# Altium schematic sheet CAN_Optical.SchDoc
size C
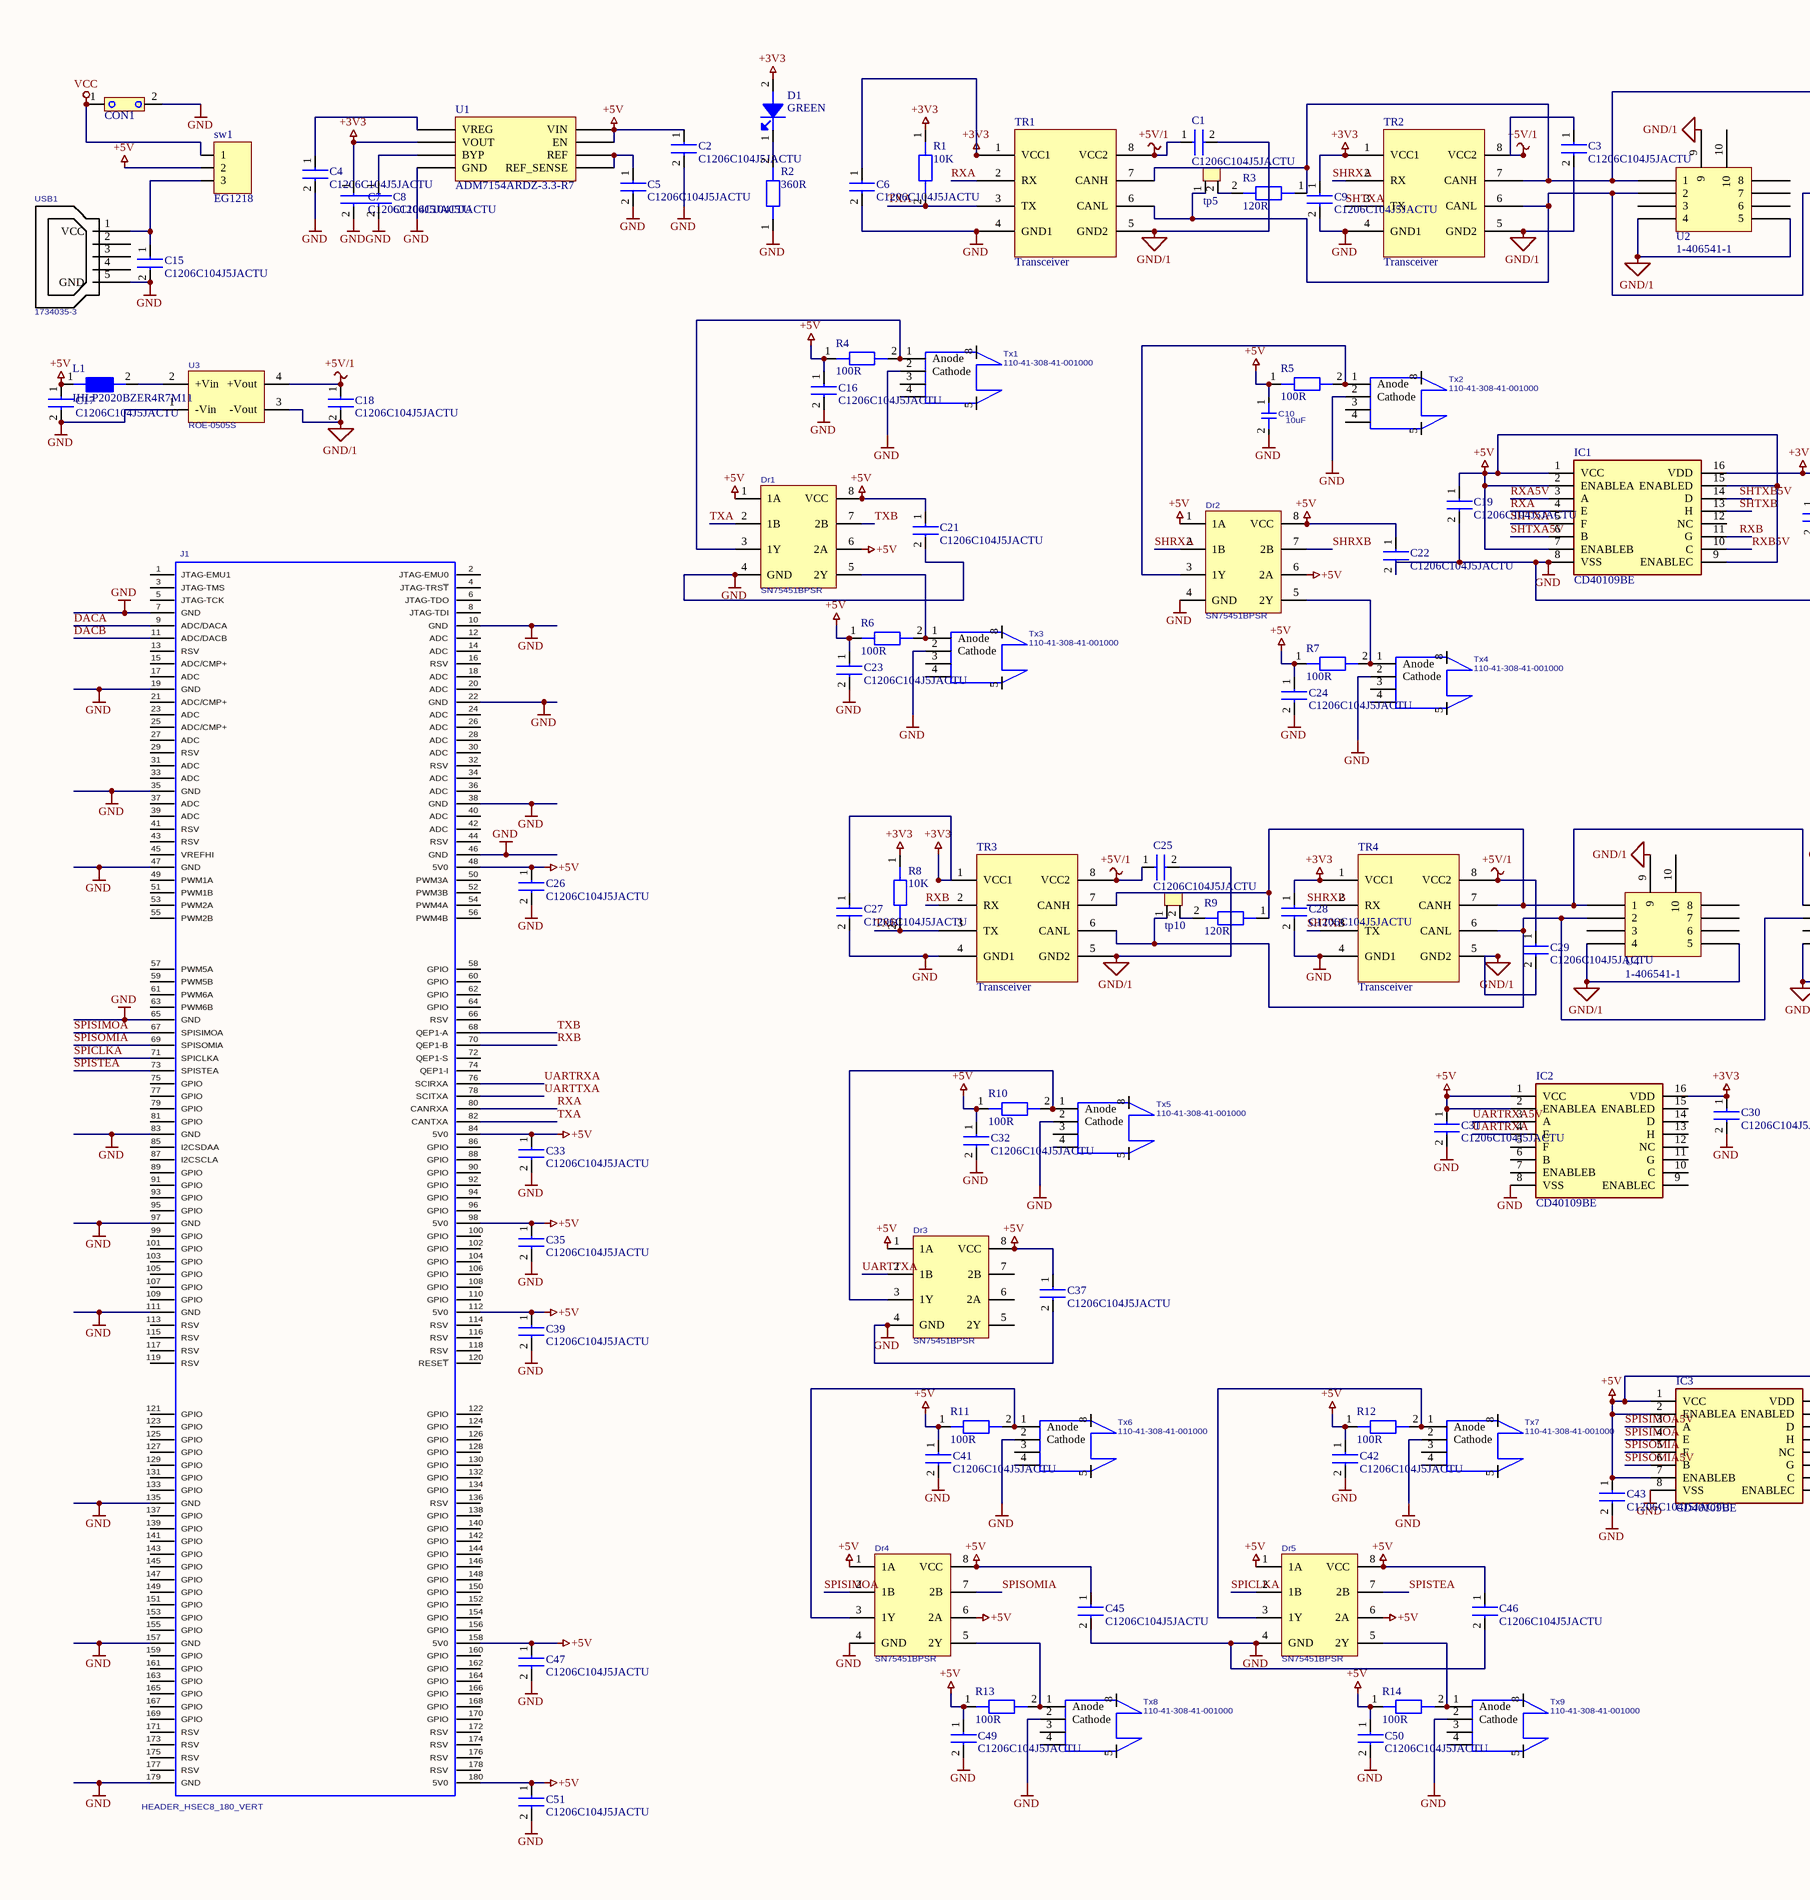
[diagram p0: CAN_Optical.SchDoc, left]
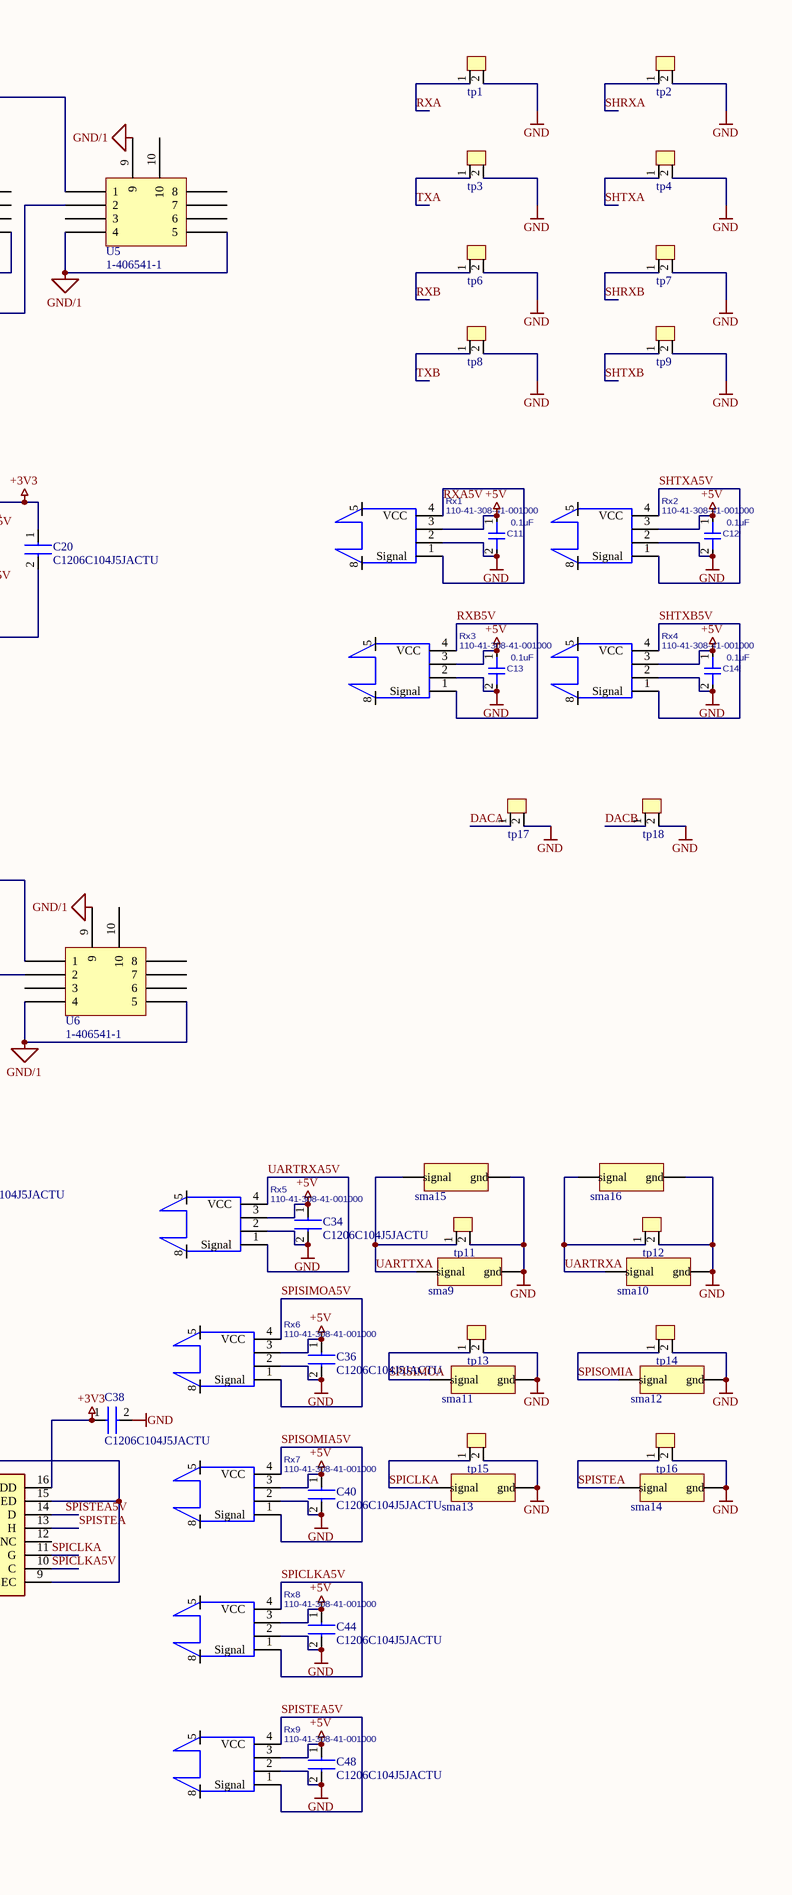
[diagram p1: CAN_Optical.SchDoc, right]

## Parts
C1  C1206C104J5JACTU  [CAPC3216X135N]
C2  C1206C104J5JACTU  [CAPC3216X135N]
C3  C1206C104J5JACTU  [CAPC3216X135N]
C4  C1206C104J5JACTU  [CAPC3216X135N]
C5  C1206C104J5JACTU  [CAPC3216X135N]
C6  C1206C104J5JACTU  [CAPC3216X135N]
C7  C1206C104J5JACTU  [CAPC3216X135N]
C8  C1206C104J5JACTU  [CAPC3216X135N]
C9  C1206C104J5JACTU  [CAPC3216X135N]
C10  10uF  [CAPC3216X135N]
C11  0.1uF  [CAPC3216X135N]
C12  0.1uF  [CAPC3216X135N]
C13  0.1uF  [CAPC3216X135N]
C14  0.1uF  [CAPC3216X135N]
C15  C1206C104J5JACTU  [CAPC3216X135N]
C16  C1206C104J5JACTU  [CAPC3216X135N]
C17  C1206C104J5JACTU  [CAPC3216X135N]
C18  C1206C104J5JACTU  [CAPC3216X135N]
C19  C1206C104J5JACTU  [CAPC3216X135N]
C20  C1206C104J5JACTU  [CAPC3216X135N]
C21  C1206C104J5JACTU  [CAPC3216X135N]
C22  C1206C104J5JACTU  [CAPC3216X135N]
C23  C1206C104J5JACTU  [CAPC3216X135N]
C24  C1206C104J5JACTU  [CAPC3216X135N]
C25  C1206C104J5JACTU  [CAPC3216X135N]
C26  C1206C104J5JACTU  [CAPC3216X135N]
C27  C1206C104J5JACTU  [CAPC3216X135N]
C28  C1206C104J5JACTU  [CAPC3216X135N]
C29  C1206C104J5JACTU  [CAPC3216X135N]
C30  C1206C104J5JACTU  [CAPC3216X135N]
C31  C1206C104J5JACTU  [CAPC3216X135N]
C32  C1206C104J5JACTU  [CAPC3216X135N]
C33  C1206C104J5JACTU  [CAPC3216X135N]
C34  C1206C104J5JACTU  [CAPC3216X135N]
C35  C1206C104J5JACTU  [CAPC3216X135N]
C36  C1206C104J5JACTU  [CAPC3216X135N]
C37  C1206C104J5JACTU  [CAPC3216X135N]
C38  C1206C104J5JACTU  [CAPC3216X135N]
C39  C1206C104J5JACTU  [CAPC3216X135N]
C40  C1206C104J5JACTU  [CAPC3216X135N]
C41  C1206C104J5JACTU  [CAPC3216X135N]
C42  C1206C104J5JACTU  [CAPC3216X135N]
C43  C1206C104J5JACTU  [CAPC3216X135N]
C44  C1206C104J5JACTU  [CAPC3216X135N]
C45  C1206C104J5JACTU  [CAPC3216X135N]
C46  C1206C104J5JACTU  [CAPC3216X135N]
C47  C1206C104J5JACTU  [CAPC3216X135N]
C48  C1206C104J5JACTU  [CAPC3216X135N]
C49  C1206C104J5JACTU  [CAPC3216X135N]
C50  C1206C104J5JACTU  [CAPC3216X135N]
C51  C1206C104J5JACTU  [CAPC3216X135N]
CON1  ED700/2  [ED700/2]  (value not drawn)
D1  GREEN  [LED0603G]
Dr1  SN75451BPSR  [SN75451BPS]
Dr2  SN75451BPSR  [SN75451BPS]
Dr3  SN75451BPSR  [SN75451BPS]
Dr4  SN75451BPSR  [SN75451BPS]
Dr5  SN75451BPSR  [SN75451BPS]
IC1  CD40109BE  [DIP794W53P254L1930H508Q16N]
IC2  CD40109BE  [DIP794W53P254L1930H508Q16N]
IC3  CD40109BE  [DIP794W53P254L1930H508Q16N]
J1  HEADER_HSEC8_180_VERT  [HEADER_HSEC8_180_DV]
L1  IHLP2020BZER4R7M11  [L_IHLP2020BZER4R7M11]
R1  10K  [R0805 - duplicate - duplicate]
R2  360R  [R0805 - duplicate - duplicate]
R3  120R  [R0805 - duplicate - duplicate]
R4  100R  [R0805 - duplicate - duplicate]
R5  100R  [R0805 - duplicate - duplicate]
R6  100R  [R0805 - duplicate - duplicate]
R7  100R  [R0805 - duplicate - duplicate]
R8  10K  [R0805 - duplicate - duplicate]
R9  120R  [R0805 - duplicate - duplicate]
R10  100R  [R0805 - duplicate - duplicate]
R11  100R  [R0805 - duplicate - duplicate]
R12  100R  [R0805 - duplicate - duplicate]
R13  100R  [R0805 - duplicate - duplicate]
R14  100R  [R0805 - duplicate - duplicate]
Rx1  110-41-308-41-001000  [HFBRX5XXZ]
Rx2  110-41-308-41-001000  [HFBRX5XXZ]
Rx3  110-41-308-41-001000  [HFBRX5XXZ]
Rx4  110-41-308-41-001000  [HFBRX5XXZ]
Rx5  110-41-308-41-001000  [HFBRX5XXZ]
Rx6  110-41-308-41-001000  [HFBRX5XXZ]
Rx7  110-41-308-41-001000  [HFBRX5XXZ]
Rx8  110-41-308-41-001000  [HFBRX5XXZ]
Rx9  110-41-308-41-001000  [HFBRX5XXZ]
sma9  142-0701-201  [142-0701-201]  (value not drawn)
sma10  142-0701-201  [142-0701-201]  (value not drawn)
sma11  142-0701-201  [142-0701-201]  (value not drawn)
sma12  142-0701-201  [142-0701-201]  (value not drawn)
sma13  142-0701-201  [142-0701-201]  (value not drawn)
sma14  142-0701-201  [142-0701-201]  (value not drawn)
sma15  142-0701-201  [142-0701-201]  (value not drawn)
sma16  142-0701-201  [142-0701-201]  (value not drawn)
sw1  EG1218  [EG1218]
tp1  tp2  [tp2]  (value not drawn)
tp2  tp2  [tp2]  (value not drawn)
tp3  tp2  [tp2]  (value not drawn)
tp4  tp2  [tp2]  (value not drawn)
tp5  tp2  [tp2]  (value not drawn)
tp6  tp2  [tp2]  (value not drawn)
tp7  tp2  [tp2]  (value not drawn)
tp8  tp2  [tp2]  (value not drawn)
tp9  tp2  [tp2]  (value not drawn)
tp10  tp2  [tp2]  (value not drawn)
tp11  tp2  [tp2]  (value not drawn)
tp12  tp2  [tp2]  (value not drawn)
tp13  tp2  [tp2]  (value not drawn)
tp14  tp2  [tp2]  (value not drawn)
tp15  tp2  [tp2]  (value not drawn)
tp16  tp2  [tp2]  (value not drawn)
tp17  tp2  [tp2]  (value not drawn)
tp18  tp2  [tp2]  (value not drawn)
TR1  Transceiver  [RXTX_ISO1050]
TR2  Transceiver  [RXTX_ISO1050]
TR3  Transceiver  [RXTX_ISO1050]
TR4  Transceiver  [RXTX_ISO1050]
Tx1  110-41-308-41-001000  [HFBRX5XXZ]
Tx2  110-41-308-41-001000  [HFBRX5XXZ]
Tx3  110-41-308-41-001000  [HFBRX5XXZ]
Tx4  110-41-308-41-001000  [HFBRX5XXZ]
Tx5  110-41-308-41-001000  [HFBRX5XXZ]
Tx6  110-41-308-41-001000  [HFBRX5XXZ]
Tx7  110-41-308-41-001000  [HFBRX5XXZ]
Tx8  110-41-308-41-001000  [HFBRX5XXZ]
Tx9  110-41-308-41-001000  [HFBRX5XXZ]
U1  ADM7154ARDZ-3.3-R7  [ADM7154ARDZ-3.3-R7]
U2  1-406541-1  [1-406541-1]
U3  ROE-0505S  [RECOM_DCDC]
U4  1-406541-1  [1-406541-1]
U5  1-406541-1  [1-406541-1]
U6  1-406541-1  [1-406541-1]
USB1  1734035-3  [USB-1734035]

## Nets
+3V3: C6.1 C7.1 C9.1 C20.1 C27.1 C28.1 C30.1 C38.1 D1.2 IC1.16(VDD) IC2.16(VDD) IC3.16(VDD) R1.1 R8.1 TR1.1(VCC1) TR2.1(VCC1) TR3.1(VCC1) TR4.1(VCC1) U1.2(VOUT)
+5V: C2.1 C10.1 C11.1 C12.1 C13.1 C14.1 C16.1 C17.1 C19.1 C21.1 C22.1 C23.1 C24.1 C26.1 C31.1 C32.1 C33.1 C34.1 C35.1 C36.1 C37.1 C39.1 C40.1 C41.1 C42.1 C43.1 C44.1 C45.1 C46.1 C47.1 C48.1 C49.1 C50.1 C51.1 Dr1.1(1A) Dr1.6(2A) Dr1.8(VCC) Dr2.1(1A) Dr2.6(2A) Dr2.8(VCC) Dr3.1(1A) Dr3.8(VCC) Dr4.1(1A) Dr4.6(2A) Dr4.8(VCC) Dr5.1(1A) Dr5.6(2A) Dr5.8(VCC) IC1.1(VCC) IC1.2(ENABLEA) IC1.7(ENABLEB) IC1.9(ENABLEC) IC1.15(ENABLED) IC2.1(VCC) IC2.2(ENABLEA) IC3.1(VCC) IC3.2(ENABLEA) IC3.7(ENABLEB) IC3.9(ENABLEC) IC3.15(ENABLED) J1.48(5V0) J1.84(5V0) J1.98(5V0) J1.112(5V0) J1.158(5V0) J1.180(5V0) L1.1 R4.1 R5.1 R6.1 R7.1 R10.1 R11.1 R12.1 R13.1 R14.1 Rx1.3 Rx2.3 Rx3.3 Rx4.3 Rx5.3 Rx6.3 Rx7.3 Rx8.3 Rx9.3 sw1.2 U1.7(EN) U1.8(VIN)
+5V/1: C1.1 C3.1 C18.1 C25.1 C29.1 TR1.8(VCC2) TR2.8(VCC2) TR3.8(VCC2) TR4.8(VCC2) U3.4(+Vout)
GND: C2.2 C4.2 C5.2 C6.2 C7.2 C8.2 C9.2 C10.2 C11.2 C12.2 C13.2 C14.2 C15.2 C16.2 C17.2 C19.2 C20.2 C21.2 C22.2 C23.2 C24.2 C26.2 C27.2 C28.2 C30.2 C31.2 C32.2 C33.2 C34.2 C35.2 C36.2 C37.2 C38.2 C39.2 C40.2 C41.2 C42.2 C43.2 C44.2 C45.2 C46.2 C47.2 C48.2 C49.2 C50.2 C51.2 CON1.2 Dr1.4(GND) Dr2.4(GND) Dr3.4(GND) Dr4.4(GND) Dr5.4(GND) IC1.8(VSS) IC2.8(VSS) IC3.8(VSS) J1.7(GND) J1.10(GND) J1.19(GND) J1.22(GND) J1.35(GND) J1.38(GND) J1.46(GND) J1.47(GND) J1.65(GND) J1.83(GND) J1.97(GND) J1.111(GND) J1.135(GND) J1.157(GND) J1.179(GND) R2.1 Rx1.2 Rx2.2 Rx3.2 Rx4.2 Rx5.2 Rx6.2 Rx7.2 Rx8.2 Rx9.2 sma9.2(gnd) sma10.2(gnd) sma11.2(gnd) sma12.2(gnd) sma13.2(gnd) sma14.2(gnd) sma15.2(gnd) sma16.2(gnd) tp1.2 tp2.2 tp3.2 tp4.2 tp6.2 tp7.2 tp8.2 tp9.2 tp11.2 tp12.2 tp13.2 tp14.2 tp15.2 tp16.2 tp17.2 tp18.2 TR1.4(GND1) TR2.4(GND1) TR3.4(GND1) TR4.4(GND1) Tx1.2(Cathode) Tx2.2(Cathode) Tx3.2(Cathode) Tx4.2(Cathode) Tx5.2(Cathode) Tx6.2(Cathode) Tx7.2(Cathode) Tx8.2(Cathode) Tx9.2(Cathode) U1.4(GND) U3.1(-Vin) USB1.5(GND)
GND/1: C1.2 C3.2 C18.2 C25.2 C29.2 TR1.5(GND2) TR2.5(GND2) TR3.5(GND2) TR4.5(GND2) U2.4 U2.5 U2.9 U3.3(-Vout) U4.4 U4.5 U4.9 U5.4 U5.5 U5.9 U6.4 U6.5 U6.9
VCC: CON1.1 sw1.1
DACA: J1.9(ADC/DACA) tp17.1
DACB: J1.11(ADC/DACB) tp18.1
RXA: IC1.4(E) J1.80(CANRXA) tp1.1 TR1.2(RX)
RXA5V: IC1.3(A) Rx1.1(Signal) Rx1.4(VCC)
RXB: IC1.11(G) J1.70(QEP1-B) tp6.1 TR3.2(RX)
RXB5V: IC1.10(C) Rx3.1(Signal) Rx3.4(VCC)
SHRXA: Dr2.2(1B) tp2.1 TR2.2(RX)
SHRXB: Dr2.7(2B) tp7.1 TR4.2(RX)
SHTXA: IC1.5(F) tp4.1 TR2.3(TX)
SHTXA5V: IC1.6(B) Rx2.1(Signal) Rx2.4(VCC)
SHTXB: IC1.13(H) tp9.1 TR4.3(TX)
SHTXB5V: IC1.14(D) Rx4.1(Signal) Rx4.4(VCC)
SPICLKA: Dr5.2(1B) IC3.11(G) J1.71(SPICLKA) sma13.1(signal) tp15.1
SPICLKA5V: IC3.10(C) Rx8.1(Signal) Rx8.4(VCC)
SPISIMOA: Dr4.2(1B) IC3.4(E) J1.67(SPISIMOA) sma11.1(signal) tp13.1
SPISIMOA5V: IC3.3(A) Rx6.1(Signal) Rx6.4(VCC)
SPISOMIA: Dr4.7(2B) IC3.5(F) J1.69(SPISOMIA) sma12.1(signal) tp14.1
SPISOMIA5V: IC3.6(B) Rx7.1(Signal) Rx7.4(VCC)
SPISTEA: Dr5.7(2B) IC3.13(H) J1.73(SPISTEA) sma14.1(signal) tp16.1
SPISTEA5V: IC3.14(D) Rx9.1(Signal) Rx9.4(VCC)
TXA: Dr1.2(1B) J1.82(CANTXA) R1.2 tp3.1 TR1.3(TX)
TXB: Dr1.7(2B) J1.68(QEP1-A) R8.2 tp8.1 TR3.3(TX)
UARTRXA: IC2.4(E) J1.76(SCIRXA) sma10.1(signal) sma16.1(signal) tp12.1
UARTRXA5V: IC2.3(A) Rx5.1(Signal) Rx5.4(VCC)
UARTTXA: Dr3.2(1B) J1.78(SCITXA) sma9.1(signal) sma15.1(signal) tp11.1
NetC4_1: C4.1 U1.1(VREG)
NetC5_1: C5.1 U1.5(REF_SENSE) U1.6(REF)
NetC8_1: C8.1 U1.3(BYP)
NetC15_1: C15.1 sw1.3 USB1.1(VCC)
NetD1_1: D1.1 R2.2
NetDr1_3: Dr1.3(1Y) R4.2 Tx1.1(Anode)
NetDr1_5: Dr1.5(2Y) R6.2 Tx3.1(Anode)
NetDr2_3: Dr2.3(1Y) R5.2 Tx2.1(Anode)
NetDr2_5: Dr2.5(2Y) R7.2 Tx4.1(Anode)
NetDr3_3: Dr3.3(1Y) R10.2 Tx5.1(Anode)
NetDr4_3: Dr4.3(1Y) R11.2 Tx6.1(Anode)
NetDr4_5: Dr4.5(2Y) R13.2 Tx8.1(Anode)
NetDr5_3: Dr5.3(1Y) R12.2 Tx7.1(Anode)
NetDr5_5: Dr5.5(2Y) R14.2 Tx9.1(Anode)
NetL1_2: L1.2 U3.2(+Vin)
NetR3_1: R3.1 TR1.7(CANH) TR2.7(CANH) U2.1 U5.1
NetR3_2: R3.2 tp5.2
NetR9_1: R9.1 TR3.7(CANH) TR4.7(CANH) U4.1 U6.1
NetR9_2: R9.2 tp10.2
Nettp5_1: tp5.1 TR1.6(CANL) TR2.6(CANL) U2.2 U5.2
Nettp10_1: tp10.1 TR3.6(CANL) TR4.6(CANL) U4.2 U6.2

Not connected (* = marked no-connect by the designer): Dr3 5(2Y) 6(2A) 7(2B); IC1 12(NC); IC2 5(F) 6(B) 7(ENABLEB) 9(ENABLEC) 10(C) 11(G) 12(NC) 13(H) 14(D) 15(ENABLED); IC3 12(NC); J1 1(JTAG-EMU1) 2(JTAG-EMU0) 3(JTAG-TMS) 4(JTAG-TRS~{T}) 5(JTAG-TCK) 6(JTAG-TDO) 8(JTAG-TDI) 12(ADC) 13(RSV) 14(ADC) 15(ADC/CMP+) 16(RSV) 17(ADC) 18(ADC) 20(ADC) 21(ADC/CMP+) 23(ADC) 24(ADC) 25(ADC/CMP+) 26(ADC) 27(ADC) 28(ADC) 29(RSV) 30(ADC) 31(ADC) 32(RSV) 33(ADC) 34(ADC) 36(ADC) 37(ADC) 39(ADC) 40(ADC) 41(RSV) 42(ADC) 43(RSV) 44(RSV) 45(VREFHI) 49(PWM1A) 50(PWM3A) 51(PWM1B) 52(PWM3B) 53(PWM2A) 54(PWM4A) 55(PWM2B) 56(PWM4B) 57(PWM5A) 58(GPIO) 59(PWM5B) 60(GPIO) 61(PWM6A) 62(GPIO) 63(PWM6B) 64(GPIO) 66(RSV) 72(QEP1-S) 74(QEP1-I) 75(GPIO) 77(GPIO) 79(GPIO) 81(GPIO) 85(I2CSDAA) 86(GPIO) 87(I2CSCLA) 88(GPIO) 89(GPIO) 90(GPIO) 91(GPIO) 92(GPIO) 93(GPIO) 94(GPIO) 95(GPIO) 96(GPIO) 99(GPIO) 100(GPIO) 101(GPIO) 102(GPIO) 103(GPIO) 104(GPIO) 105(GPIO) 106(GPIO) 107(GPIO) 108(GPIO) 109(GPIO) 110(GPIO) 113(RSV) 114(RSV) 115(RSV) 116(RSV) 117(RSV) 118(RSV) 119(RSV) 120(RESE~{T}) 121(GPIO) 122(GPIO) 123(GPIO) 124(GPIO) 125(GPIO) 126(GPIO) 127(GPIO) 128(GPIO) 129(GPIO) 130(GPIO) 131(GPIO) 132(GPIO) 133(GPIO) 134(GPIO) 136(RSV) 137(GPIO) 138(GPIO) 139(GPIO) 140(GPIO) 141(GPIO) 142(GPIO) 143(GPIO) 144(GPIO) 145(GPIO) 146(GPIO) 147(GPIO) 148(GPIO) 149(GPIO) 150(GPIO) 151(GPIO) 152(GPIO) 153(GPIO) 154(GPIO) 155(GPIO) 156(GPIO) 159(GPIO) 160(GPIO) 161(GPIO) 162(GPIO) 163(GPIO) 164(GPIO) 165(GPIO) 166(GPIO) 167(GPIO) 168(GPIO) 169(GPIO) 170(GPIO) 171(RSV) 172(RSV) 173(RSV) 174(RSV) 175(RSV) 176(RSV) 177(RSV) 178(RSV); Rx1 5 8(6); Rx2 5 8(6); Rx3 5 8(6); Rx4 5 8(6); Rx5 5 8(6); Rx6 5 8(6); Rx7 5 8(6); Rx8 5 8(6); Rx9 5 8(6); Tx1 3 4 5 8(6); Tx2 3 4 5 8(6); Tx3 3 4 5 8(6); Tx4 3 4 5 8(6); Tx5 3 4 5 8(6); Tx6 3 4 5 8(6); Tx7 3 4 5 8(6); Tx8 3 4 5 8(6); Tx9 3 4 5 8(6); U2 3 6 7 8 10; U4 3 6 7 8 10; U5 3 6 7 8 10; U6 3 6 7 8 10; USB1 2 3 4

## Library data of the parts
C1-C9 C15-C51 = C1206C104J5JACTU: Capacitor; Manufacturer_Name: Kemet; Datasheet Link: https://api.kemet.com/component-edge/download/datasheet/C1206C104J5JACTU.pdf; Height: 1.35mm; Manufacturer_Part_Number: C1206C104J5JACTU
C10-C14 = C0603C104K8RACTU: KEMET - C0603C104K8RACTU - SMD Multilayer Ceramic Capacitor, 0.1 µF, 10 V, 0603 [1608 Metric], ± 10%, X7R, C Series KEMET; Capacitance: 100nF; Voltage Rating (DC): 10V; Dissipation Factor: 5%; Supplier 1: Digi-Key; Manufacturer: KEMET; Manufacturer Part Number: C0603C104K8RACTU; Stock 1: 311118; Pricing 1: 1=0.14, 10=0.098, 100=0.0462, 500=0.0324, 1000=0.02683 (USD); Mount: Surface Mount,PCB; Case/Package: 0603; Number of Pins: 2; Dielectric Material: Ceramic; Case Code (Imperial): 0603; Case Code (Metric): 1608; Contact Plating: Tin,Matte; Min Operating Temperature: -55°C; Max Operating Temperature: 125°C; Tolerance: 10%; Dielectric: X7R; Packaging: Tape and Reel; Package Quantity: 1; Termination: SMD/SMT; Voltage Rating: 10V; Voltage: 10V; Length: 1.6mm; Height: 0.8mm; Depth: 0.8mm; Width: 0.8mm; Lead Pitch: 0.7mm; Thickness: 0.034inch; Radiation Hardening: No; REACH SVHC: No SVHC; ComponentLink1URL: http://www.farnell.com/datasheets/2740421.pdf?src-supplier=Farnell; ComponentLink1Description: http://www.farnell.com/datasheets/2740421.pdf?src-supplier=Farnell; ComponentLink2URL: http://www.kemet.com/kemet/web/homepage/kechome.nsf/vapubfiles/KEM_C1002_X7R_SMD.pdf/$file/KEM_C1002_X7R_SMD.pdf?src-supplier=Element14; ComponentLink2Description: http://www.kemet.com/kemet/web/homepage/kechome.nsf/vapubfiles/KEM_C1002_X7R_SMD.pdf/$file/KEM_C1002_X7R_SMD.pdf?src-supplier=Element14; ComponentLink3URL: https://www.verical.com/server-webapp/html/getDatasheet?partID=91529&src-supplier=Verical; ComponentLink3Description: https://www.verical.com/server-webapp/html/getDatasheet?partID=91529&src-supplier=Verical; ComponentLink4URL: http://www.mouser.com/ds/2/212/KEM_C1002_X7R_SMD-1102033.pdf?src-supplier=Mouser; ComponentLink4Description: http://www.mouser.com/ds/2/212/KEM_C1002_X7R_SMD-1102033.pdf?src-supplier=Mouser; ComponentLink5URL: http://www.alliedelec.com/m/d/9bfe7773041ffe9d406e68bc7b377fdd.pdf?src-supplier=Allied+Electronics; ComponentLink5Description: http://www.alliedelec.com/m/d/9bfe7773041ffe9d406e68bc7b377fdd.pdf?src-supplier=Allied+Electronics; ComponentLink6URL: http://www.farnell.com/datasheets/2740421.pdf?src-supplier=Element14; ComponentLink6Description: http://www.farnell.com/datasheets/2740421.pdf?src-supplier=Element14; Category: Multilayer Ceramic Capacitors MLCC
D1 = ERJ-3EKF8062V: PANASONIC - ERJ3EKF8062V - Surface Mount Thick Film Resistor, AEC-Q200 ERJ Series, 80.6 kohm, 100 mW, -  1%, 75 V RoHS Compliant: Yes; Voltage Rating: 75V; Temperature Coefficient: 100ppm/°C; Max Power Dissipation: 100mW; Resistance: 80.6kR; Supplier 1: Digi-Key; Supplier Part Number 1: P80.6KHCT-ND; Manufacturer 1: Panasonic; Manufacturer Part Number 1: ERJ-3EKF8062V; Stock 1: 56636; Pricing 1: 1=0.10000, 10=0.05700, 100=0.02340, 1000=0.01049, 2500=0.00911 (USD); RoHS: Yes; Mount: Surface Mount; Case/Package: 0603; Contact Plating: Tin; Case Code (Imperial): 0603; Case Code (Metric): 1608; Min Operating Temperature: -55°C; Max Operating Temperature: 155°C; Packaging: Tape and Reel; Package Quantity: 1; Termination: SMD/SMT; Tolerance: 1%; Composition: Thick Film; Number of Terminations: 2; Power Rating: 100mW; Features: Automotive AEC-Q200; Military Standard: Not; Length: 1.6mm; Height: 0.45mm; Depth: 0.8mm; Width: 0.8mm; Radiation Hardening: No; REACH SVHC: No SVHC; ComponentLink1URL: https://datasheet.ciiva.com/34303/1988428-34303606.pdf?src-supplier=Jameco; ComponentLink1Description: https://datasheet.ciiva.com/34303/1988428-34303606.pdf?src-supplier=Jameco; ComponentLink2URL: https://datasheet.ciiva.com/26820/getdatasheetpartid-28772-26820919.pdf?src-supplier=Verical; ComponentLink2Description: https://datasheet.ciiva.com/26820/getdatasheetpartid-28772-26820919.pdf?src-supplier=Verical; ComponentLink3URL: https://datasheet.ciiva.com/28540/1678782-28540761.pdf?src-supplier=Element14; ComponentLink3Description: https://datasheet.ciiva.com/28540/1678782-28540761.pdf?src-supplier=Element14; ComponentLink4URL: https://datasheet.ciiva.com/30240/aoa0000ce2-30240122.pdf?src-supplier=Onlinecomponents.com; ComponentLink4Description: https://datasheet.ciiva.com/30240/aoa0000ce2-30240122.pdf?src-supplier=Onlinecomponents.com; ComponentLink5URL: https://datasheet.ciiva.com/9117/aoa0000ce2-9117181.pdf?src-supplier=Avnet; ComponentLink5Description: https://datasheet.ciiva.com/9117/aoa0000ce2-9117181.pdf?src-supplier=Avnet; ComponentLink6URL: https://datasheet.ciiva.com/16767/70260748-16767567.pdf?src-supplier=Allied+Electronics; ComponentLink6Description: https://datasheet.ciiva.com/16767/70260748-16767567.pdf?src-supplier=Allied+Electronics; ComponentLink7URL: https://datasheet.ciiva.com/16771/70260748-16771423.pdf?src-supplier=Allied+Electronics; ComponentLink7Description: https://datasheet.ciiva.com/16771/70260748-16771423.pdf?src-supplier=Allied+Electronics; ComponentLink8URL: https://datasheet.ciiva.com/24069/aoa0000ce2-24069717.pdf?src-supplier=Mouser; ComponentLink8Description: https://datasheet.ciiva.com/24069/aoa0000ce2-24069717.pdf?src-supplier=Mouser; ComponentLink9URL: https://datasheet.ciiva.com/43460/426256-43460613.pdf?src-supplier=Farnell; ComponentLink9Description: https://datasheet.ciiva.com/43460/426256-43460613.pdf?src-supplier=Farnell; ComponentLink10URL: https://datasheet.ciiva.com/46390/426256-46390277.pdf?src-supplier=Element14; ComponentLink10Description: https://datasheet.ciiva.com/46390/426256-46390277.pdf?src-supplier=Element14; ComponentLink11URL: https://datasheet.ciiva.com/46378/426256-46378107.pdf?src-supplier=Element14; ComponentLink11Description: https://datasheet.ciiva.com/46378/426256-46378107.pdf?src-supplier=Element14; ComponentLink12URL: https://datasheet.ciiva.com/17208/aoa0000ce2-17208604.pdf?src-supplier=Avnet+Europe; ComponentLink12Description: https://datasheet.ciiva.com/17208/aoa0000ce2-17208604.pdf?src-supplier=Avnet+Europe; ComponentLink13URL: https://datasheet.ciiva.com/6159/426256-6159621.pdf?src-supplier=Farnell; ComponentLink13Description: https://datasheet.ciiva.com/6159/426256-6159621.pdf?src-supplier=Farnell; Category: Optoelectronics
Dr1 Dr3-Dr5 = SN75451BPSRG4: IC DUAL PERIPHERAL DRVR 8-SOP; Manufacturer: Texas Instruments; Number of Drivers: 2; Propagation Delay: 25ns; Nominal Supply Current: 65mA; Turn-On Delay Time: 8ns; Turn-Off Delay Time: 12ns; Output Voltage: 30V; Output Current: 300mA; Operating Supply Voltage: 5.25V; Max Input Voltage: 5.5V; Supplier 1: Digi-Key; Manufacturer Part Number: SN75451BPSR; Stock 1: 0; Mount: Surface Mount; Case/Package: SOP; Number of Pins: 8; Weight: 0.004325oz; Min Operating Temperature: 0°C; Max Operating Temperature: 70°C; Packaging: Tape and Reel; Package Quantity: 2000; Number of Outputs: 2; Max Supply Current: 65mA; Radiation Hardening: No; Lead Free: Contains Lead; ComponentLink1URL: https://www.verical.com/server-webapp/html/getDatasheet?partID=528972&src-supplier=Verical; ComponentLink1Description: https://www.verical.com/server-webapp/html/getDatasheet?partID=528972&src-supplier=Verical; ComponentLink2URL: http://www.ti.com/lit/ds/symlink/sn75462.pdf?src-supplier=Digi-Key; ComponentLink2Description: http://www.ti.com/lit/ds/symlink/sn75462.pdf?src-supplier=Digi-Key; ComponentLink3URL: http://www.ti.com/lit/ds/slrs021b/slrs021b.pdf?src-supplier=Avnet; ComponentLink3Description: http://www.ti.com/lit/ds/slrs021b/slrs021b.pdf?src-supplier=Avnet; Category: Buffers & Line Drivers
Dr2 = SN75451BPSR: IC DUAL PERIPHERAL DRVR 8-SOP; Manufacturer: Texas Instruments; Number of Drivers: 2; Propagation Delay: 25ns; Nominal Supply Current: 65mA; Turn-On Delay Time: 8ns; Turn-Off Delay Time: 12ns; Output Voltage: 30V; Output Current: 300mA; Operating Supply Voltage: 5.25V; Max Input Voltage: 5.5V; Supplier 1: Digi-Key; Manufacturer Part Number: SN75451BPSR; Stock 1: 0; Mount: Surface Mount; Case/Package: SOP; Number of Pins: 8; Weight: 0.004325oz; Min Operating Temperature: 0°C; Max Operating Temperature: 70°C; Packaging: Tape and Reel; Package Quantity: 2000; Number of Outputs: 2; Max Supply Current: 65mA; Radiation Hardening: No; Lead Free: Contains Lead; ComponentLink1URL: https://www.verical.com/server-webapp/html/getDatasheet?partID=528972&src-supplier=Verical; ComponentLink1Description: https://www.verical.com/server-webapp/html/getDatasheet?partID=528972&src-supplier=Verical; ComponentLink2URL: http://www.ti.com/lit/ds/symlink/sn75462.pdf?src-supplier=Digi-Key; ComponentLink2Description: http://www.ti.com/lit/ds/symlink/sn75462.pdf?src-supplier=Digi-Key; ComponentLink3URL: http://www.ti.com/lit/ds/slrs021b/slrs021b.pdf?src-supplier=Avnet; ComponentLink3Description: http://www.ti.com/lit/ds/slrs021b/slrs021b.pdf?src-supplier=Avnet; Category: Buffers & Line Drivers
IC1-IC3 = CD40109BE: Integrated Circuit; Manufacturer_Name: Texas Instruments; Datasheet Link: http://www.ti.com/lit/ds/symlink/cd40109b.pdf; Height: 5.08mm; Mouser2 Part Number: 595-CD40109BE; Mouser2 Price/Stock: https://www.mouser.com/Search/Refine.aspx?Keyword=595-CD40109BE; Manufacturer_Part_Number: CD40109BE
J1 = HEADER_HSEC8_180_VERT: 180 pin (120 + 60) HSEC8 socket, samtec; Digi-Key Part Number: SAM9083-ND & SAM9080-ND
L1 = IHLP2020BZER4R7M11: FIXED IND 4.7UH 3.2A 81.3 MOHM; Manufacturer: Vishay Dale; Core Material: Metal,Composite,Ferrite; Inductance Tolerance: 20%; Self Resonant Frequency: 27MHz; Shielding: Shielded; Saturation Current: 3A; DC Resistance (DCR): 81.3mR; Test Frequency: 100kHz; Supplier 1: Digi-Key; Manufacturer Part Number: IHLP2020BZER4R7M11; Stock 1: 25026; Pricing 1: 1=2.39, 10=2.208, 100=1.5456, 500=1.2512, 1000=1.1408 (USD); Mount: Surface Mount; Case/Package: 2020; Number of Pins: 2020; Min Operating Temperature: -55°C; Max Operating Temperature: 125°C; Tolerance: 20%; Packaging: Tape and Reel; Inductance: 4.7uH; Package Quantity: 2000; Current Rating: 3.2A; Max DC Current: 3A; Termination: SMD/SMT; RMS Current (Irms): 3.2A; Military Standard: Not; Length: 5.49mm; Height: 2mm; Width: 0.204inch; Height - Seated (Max): 0.079inch; Depth: 5.43mm; Radiation Hardening: No; REACH SVHC: Unknown; Lead Free: Lead Free; ComponentLink1URL: http://www.vishay.com/docs/34261/lp20bz11.pdf?src-supplier=Future+Electronics; ComponentLink1Description: http://www.vishay.com/docs/34261/lp20bz11.pdf?src-supplier=Future+Electronics; ComponentLink2URL: http://uk.rs-online.com/webdocs/102c/0900766b8102c92e.pdf?src-supplier=RSComponents; ComponentLink2Description: http://uk.rs-online.com/webdocs/102c/0900766b8102c92e.pdf?src-supplier=RSComponents; ComponentLink3URL: http://www.vishay.com/docs/34261/ihlp2020bz11.pdf?src-supplier=Digi-Key; ComponentLink3Description: http://www.vishay.com/docs/34261/ihlp2020bz11.pdf?src-supplier=Digi-Key; Category: Inductors, Coils, Chokes
R1 R3-R14 = CRCW0805360RFKEA: Res Thick Film 0805 360 Ohm 1% 0.125W(1/8W) ±100ppm/C Molded SMD Automotive Paper T/R; Manufacturer 1: Vishay; Temperature Coefficient: 100ppm/°C; Max Power Dissipation: 125mW; Voltage Rating (DC): 150V; Resistance: 360R; Supplier 1: Digi-Key; Supplier Part Number 1: 541-360CCT-ND; Manufacturer Part Number 1: CRCW0805360RFKEA; Stock 1: 2468; Pricing 1: 1=0.10000, 10=0.06200, 100=0.02540, 1000=0.01142, 2500=0.00991 (USD); RoHS: Yes; Case/Package: 0805; Number of Pins: 2; Weight: 0.000194oz; Contact Plating: Tin; Case Code (Metric): 2012; Case Code (Imperial): 0805; Number of Terminals: 2; Min Operating Temperature: -55°C; Max Operating Temperature: 155°C; Number of Terminations: 2; Features: Automotive AEC-Q200; Tolerance: 1%; Packaging: Tape and Reel; Composition: Thick Film; Package Quantity: 10; Termination: SMD/SMT; Military Standard: Not; Power Rating: 125mW; Voltage Rating: 150V; Length: 2mm; Height: 0.45mm; Width: 0.049inch; Depth: 1.25mm; Radiation Hardening: No; Lead Free: Lead Free; REACH SVHC: Unknown; ComponentLink1URL: https://datasheet.ciiva.com/2467/dcrcwe3-2467773.pdf?src-supplier=Digi-Key; ComponentLink1Description: https://datasheet.ciiva.com/2467/dcrcwe3-2467773.pdf?src-supplier=Digi-Key; Category: Resistors
R2 = CRCW0805360RFKEA: Res Thick Film 0805 360 Ohm 1% 0.125W(1/8W) ±100ppm/C Molded SMD Automotive Paper T/R; Manufacturer 1: Vishay; Temperature Coefficient: 100ppm/°C; Max Power Dissipation: 125mW; Voltage Rating (DC): 150V; Supplier 1: Digi-Key; Supplier Part Number 1: 541-360CCT-ND; Manufacturer Part Number 1: CRCW0805360RFKEA; Stock 1: 2468; Pricing 1: 1=0.10000, 10=0.06200, 100=0.02540, 1000=0.01142, 2500=0.00991 (USD); RoHS: Yes; Case/Package: 0805; Number of Pins: 2; Weight: 0.000194oz; Contact Plating: Tin; Case Code (Metric): 2012; Case Code (Imperial): 0805; Number of Terminals: 2; Min Operating Temperature: -55°C; Max Operating Temperature: 155°C; Number of Terminations: 2; Features: Automotive AEC-Q200; Resistance: 360R; Tolerance: 1%; Packaging: Tape and Reel; Composition: Thick Film; Package Quantity: 10; Termination: SMD/SMT; Military Standard: Not; Power Rating: 125mW; Voltage Rating: 150V; Length: 2mm; Height: 0.45mm; Width: 0.049inch; Depth: 1.25mm; Radiation Hardening: No; Lead Free: Lead Free; REACH SVHC: Unknown; ComponentLink1URL: https://datasheet.ciiva.com/2467/dcrcwe3-2467773.pdf?src-supplier=Digi-Key; ComponentLink1Description: https://datasheet.ciiva.com/2467/dcrcwe3-2467773.pdf?src-supplier=Digi-Key; Category: Resistors
Rx1-Rx9 = HFBR-2521Z: IC & Component Sockets 8 PIN SKT 200u Sn; Manufacturer: Broadcom; Wavelength: 660nm; Operating Supply Current: 10mA; Supplier 1: Digi-Key; Manufacturer Part Number: 110-41-308-41-001000; Stock 1: 3382; Pricing 1: 1=11.78, 10=10.666, 100=7.1104, 500=6.1105, 1000=5.7772, 2500=5.64388, 5000=5.555, 10000=5.4439 (USD); REACH SVHC: No SVHC
TR1-TR4 = ISO1050DUBR: CAN 1Mbps 3.3V/5V 8-Pin SOP; Manufacturer: Texas Instruments; Number of Transmit Buffers: 1; Min Supply Voltage: 3V; Max Supply Voltage: 5.5V; Propagation Delay: 74ns; Output Current: 70mA; Output Voltage: 5V; Polarity: Unidirectional; Operating Supply Current: 52mA; Max Power Dissipation: 200mW; Working Voltage: 1.2V; Supplier 1: Digi-Key; Manufacturer Part Number: ISO1050DUBR; Stock 1: 11666; Pricing 1: 1=4.9, 10=4.398, 25=4.158, 100=3.4188 (USD); Case/Package: SOP; Number of Pins: 8; Weight: 0.030018oz; Contact Plating: Gold; Min Operating Temperature: -55°C; Max Operating Temperature: 105°C; Package Quantity: 1; Packaging: Tape and Reel; Number of Receive Buffers: 1; Data Rate: 1Mbps; Number of Channels: 1; Number of Transceivers: 1; Termination: SMD/SMT; Number of Drivers: 1; Operating Supply Voltage: 5V; Radiation Hardening: No; REACH SVHC: No SVHC; Lead Free: Lead Free; ComponentLink1URL: http://www.ti.com/lit/ds/symlink/iso1050.pdf?src-supplier=Digi-Key; ComponentLink1Description: http://www.ti.com/lit/ds/symlink/iso1050.pdf?src-supplier=Digi-Key; ComponentLink2URL: http://www.farnell.com/datasheets/1972904.pdf?src-supplier=Element14; ComponentLink2Description: http://www.farnell.com/datasheets/1972904.pdf?src-supplier=Element14; ComponentLink3URL: https://www.verical.com/server-webapp/html/getDatasheet?partID=330373&src-supplier=Verical; ComponentLink3Description: https://www.verical.com/server-webapp/html/getDatasheet?partID=330373&src-supplier=Verical; ComponentLink4URL: http://sg.element14.com/webapp/wcs/stores/servlet/OpenCAD?catalogId=15001&langId=65&id=800000158048&storeId=10191&returnURL=http%3A%2F%2Fsg.element14.com%2Ftexas-instruments%2Fiso1050dubr%2Fic-can-transceiver-isolated-5v%2Fdp%2F1755712&src-supplier=Element14; ComponentLink4Description: http://sg.element14.com/webapp/wcs/stores/servlet/OpenCAD?catalogId=15001&langId=65&id=800000158048&storeId=10191&returnURL=http%3A%2F%2Fsg.element14.com%2Ftexas-instruments%2Fiso1050dubr%2Fic-can-transceiver-isolated-5v%2Fdp%2F1755712&src-supplier=Element14; ComponentLink5URL: http://www.produktinfo.conrad.com/datenblaetter/1100000-1199999/001187118-da-01-en-IC_TXRX_CAN_5V_ISO_ISO1050DUBR_SOP_8_TID.pdf?src-supplier=Conrad; ComponentLink5Description: http://www.produktinfo.conrad.com/datenblaetter/1100000-1199999/001187118-da-01-en-IC_TXRX_CAN_5V_ISO_ISO1050DUBR_SOP_8_TID.pdf?src-supplier=Conrad; ComponentLink6URL: http://datasheet.iiic.cc/texas_instruments/ISO1050DUBR.pdf?src-supplier=IIIC; ComponentLink6Description: http://datasheet.iiic.cc/texas_instruments/ISO1050DUBR.pdf?src-supplier=IIIC; Category: Interface - Drivers, Receivers, Transceivers
Tx1-Tx9 = HFBR-1527Z: IC & Component Sockets 8 PIN SKT 200u Sn; Manufacturer: Broadcom Avago; Operating Supply Voltage: 5V; Forward Voltage: 2.1V; Wavelength: 650nm; Data Rate: 1Mbps; Capacitance: 60pF; Forward Current: 80mA; Max Reverse Voltage (DC): 3V; Rise Time: 12ns; Fall Time: 9ns; Supplier 1: Digi-Key; Manufacturer Part Number: 110-41-308-41-001000; Stock 1: 1407; Pricing 1: 1=12.01, 10=11.499, 100=7.6659, 500=6.89932, 1000=6.51602, 2500=6.38825, 5000=6.26049, 10000=6.23493 (USD); Mount: Snap in,Through Hole; Number of Pins: 6; Min Operating Temperature: 0°C; Max Operating Temperature: 70°C; Package Quantity: 200; Reverse Voltage (DC): 5V; Packaging: Rail/Tube; Length: 19.6mm; Height: 7.71mm; Width: 10.4mm; Radiation Hardening: No; REACH SVHC: No SVHC; Lead Free: Lead Free; ComponentLink1URL: http://www.farnell.com/datasheets/67624.pdf?src-supplier=Element14; ComponentLink1Description: http://www.farnell.com/datasheets/67624.pdf?src-supplier=Element14; ComponentLink2URL: http://www1.futureelectronics.com/doc/AVAGO%20TECHNOLOGIES/HFBR-1527Z.pdf?src-supplier=Future+Electronics; ComponentLink2Description: http://www1.futureelectronics.com/doc/AVAGO%20TECHNOLOGIES/HFBR-1527Z.pdf?src-supplier=Future+Electronics; ComponentLink3URL: https://www.distrelec.biz/Web/Downloads/_t/ds/HFBR-0500Z_eng_tds.pdf?mime=application%2Fpdf&src-supplier=Distrelec; ComponentLink3Description: https://www.distrelec.biz/Web/Downloads/_t/ds/HFBR-0500Z_eng_tds.pdf?mime=application%2Fpdf&src-supplier=Distrelec; ComponentLink4URL: https://www.verical.com/server-webapp/html/getDatasheet?partID=95209&src-supplier=Verical; ComponentLink4Description: https://www.verical.com/server-webapp/html/getDatasheet?partID=95209&src-supplier=Verical; ComponentLink5URL: http://uk.rs-online.com/webdocs/0a20/0900766b80a20828.pdf?src-supplier=RSComponents; ComponentLink5Description: http://uk.rs-online.com/webdocs/0a20/0900766b80a20828.pdf?src-supplier=RSComponents; ComponentLink6URL: http://datasheet.iiic.cc/avago_technologies/HFBR-1527Z.pdf?src-supplier=IIIC; ComponentLink6Description: http://datasheet.iiic.cc/avago_technologies/HFBR-1527Z.pdf?src-supplier=IIIC; Category: Fiber Optic Transmitters
U1 = ADM7154ARDZ-3.3-R7: Linear Voltage Regulator IC Positive Fixed 1 Output 3.3V 600mA 8-SOIC-EP; Digi-Key Part Number: ADM7154ARDZ-3.3-R7CT-ND
U3 = ROE-0505S: Module DC-DC 5VIN 1-OUT 5V 0.2A 1W 4-Pin SIP Tube; Manufacturer: Recom; Min Input Voltage: 4.5V; Max Input Voltage: 5.5V; Number of Outputs: 1; Max Output Current: 200mA; Efficiency: 75%; Isolation Voltage: 1kV; Isolation: Isolated; Supplier 1: Digi-Key; Manufacturer Part Number: ROE-0505S; Stock 1: 4706; Pricing 1: 1=2.64, 5=2.604, 10=2.567, 25=2.4916, 50=2.416, 100=2.3405, 250=2.265, 500=2.114 (USD); Mount: Through Hole; Case/Package: SIP; Number of Pins: 4; Weight: 1.4g; Min Operating Temperature: -40°C; Max Operating Temperature: 85°C; Nominal Output Voltage: 5V; Output Current: 200mA; Output Voltage: 5V; Power Rating: 1W; Nominal Input Voltage: 5V; Output Power: 1W; Package Quantity: 42; Packaging: Rail/Tube; Min Input Voltage (DC): 4.5V; Voltage - Output 1: 5V; Current - Output 1: 200mA; Max Input Voltage (DC): 5.5V; Max Output Power: 1W; Max Power Dissipation: 1W; Max Output Voltage: 5V; Length: 11.5mm; Height: 10mm; Width: 6mm; Depth: 6mm; REACH SVHC: No SVHC; Lead Free: Lead Free; ComponentLink1URL: http://www.farnell.com/datasheets/2787770.pdf?src-supplier=Element14; ComponentLink1Description: http://www.farnell.com/datasheets/2787770.pdf?src-supplier=Element14; ComponentLink2URL: http://www.mouser.com/ds/2/468/ROE-766139.pdf?src-supplier=Mouser; ComponentLink2Description: http://www.mouser.com/ds/2/468/ROE-766139.pdf?src-supplier=Mouser; ComponentLink3URL: https://www.recom-power.com/pdf/Econoline/ROE.pdf?src-supplier=Digi-Key; ComponentLink3Description: https://www.recom-power.com/pdf/Econoline/ROE.pdf?src-supplier=Digi-Key; ComponentLink4URL: http://www.recom-international.com/pdf/Econoline/ROE.pdf?src-supplier=Future+Electronics; ComponentLink4Description: http://www.recom-international.com/pdf/Econoline/ROE.pdf?src-supplier=Future+Electronics; ComponentLink5URL: http://uk.rs-online.com/webdocs/1373/0900766b81373201.pdf?src-supplier=RSComponents; ComponentLink5Description: http://uk.rs-online.com/webdocs/1373/0900766b81373201.pdf?src-supplier=RSComponents; ComponentLink6URL: http://www.produktinfo.conrad.com/datenblaetter/675000-699999/676228-da-01-en-DC_DC_WANDLER_ROE_0505S.pdf?src-supplier=Conrad; ComponentLink6Description: http://www.produktinfo.conrad.com/datenblaetter/675000-699999/676228-da-01-en-DC_DC_WANDLER_ROE_0505S.pdf?src-supplier=Conrad; Category: Power Supply
USB1 = 1734035-3: CONN MINI B USB R/A SMD; Manufacturer: TE Connectivity; Plating: Nickel; Connector Type: Receptacle; Number of Ports: 1; Number of Positions: 5; Plating Thickness: 0.76um; Circuit Application: Power; Connector System: Cable-to-Board; Contact Current Rating: 1A; Pitch: 0.8mm; PCB Thickness: 1.57mm; Supplier 1: Digi-Key; Manufacturer Part Number: 1734035-3; Stock 1: 11601; Pricing 1: 1=1.37, 10=1.239, 25=1.1636, 50=1.113, 100=1.0624, 250=0.96124 (USD); Mount: Surface Mount,Horizontal; Contact Plating: Gold; Housing Color: Black; Contact Material: Bronze; Number of Terminals: 5; Housing Material: Thermoplastic; Color: Black; Min Operating Temperature: -40°C; Max Operating Temperature: 85°C; Termination: SMD/SMT; Orientation: Right Angle; Packaging: Tape and Reel; Package Quantity: 700; Gender: Receptacle; Number of Contacts: 5; Length: 8.45mm; Width: 7.7mm; Radiation Hardening: No; ELV: Compliant; Flammability Rating: UL94 V-0; Lead Free: Lead Free; ComponentLink1URL: http://www.te.com/commerce/DocumentDelivery/DDEController?Action=showdoc&DocId=Customer+Drawing%7F1734035%7FA%7Fpdf%7FEnglish%7FENG_CD_1734035_A.pdf&src-supplier=Avnet; ComponentLink1Description: http://www.te.com/commerce/DocumentDelivery/DDEController?Action=showdoc&DocId=Customer+Drawing%7F1734035%7FA%7Fpdf%7FEnglish%7FENG_CD_1734035_A.pdf&src-supplier=Avnet; ComponentLink2URL: http://www.te.com/commerce/DocumentDelivery/DDEController?Action=showdoc&DocId=Customer+Drawing%7F1734035%7FA%7Fpdf%7FEnglish%7FENG_CD_1734035_A.pdf&src-supplier=Avnet+Europe; ComponentLink2Description: http://www.te.com/commerce/DocumentDelivery/DDEController?Action=showdoc&DocId=Customer+Drawing%7F1734035%7FA%7Fpdf%7FEnglish%7FENG_CD_1734035_A.pdf&src-supplier=Avnet+Europe; ComponentLink3URL: http://www.mouser.com/ds/2/418/NG_CD_1734035_F-617298.pdf?src-supplier=Mouser; ComponentLink3Description: http://www.mouser.com/ds/2/418/NG_CD_1734035_F-617298.pdf?src-supplier=Mouser; ComponentLink4URL: http://www.te.com/commerce/DocumentDelivery/DDEController?Action=srchrtrv&DocNm=1734035&DocType=Customer+Drawing&DocLang=English&src-supplier=Digi-Key; ComponentLink4Description: http://www.te.com/commerce/DocumentDelivery/DDEController?Action=srchrtrv&DocNm=1734035&DocType=Customer+Drawing&DocLang=English&src-supplier=Digi-Key; Category: USB Connectors
CON1 = ED700/2: Digi-Key Part Number: ED1631-ND
sma9-sma16 = 142-0701-201: Digi-Key Part Number: J500-ND
sw1 = EG1218: Digi-Key Part Number: EG1903-ND
tp1-tp18 = tp2: Digi-Key Part Number: S1012EC-10-ND
U2 U4-U6 = 1-406541-1: Digi-Key Part Number: A97716-ND